# Altium project MiniCar.PrjPcb
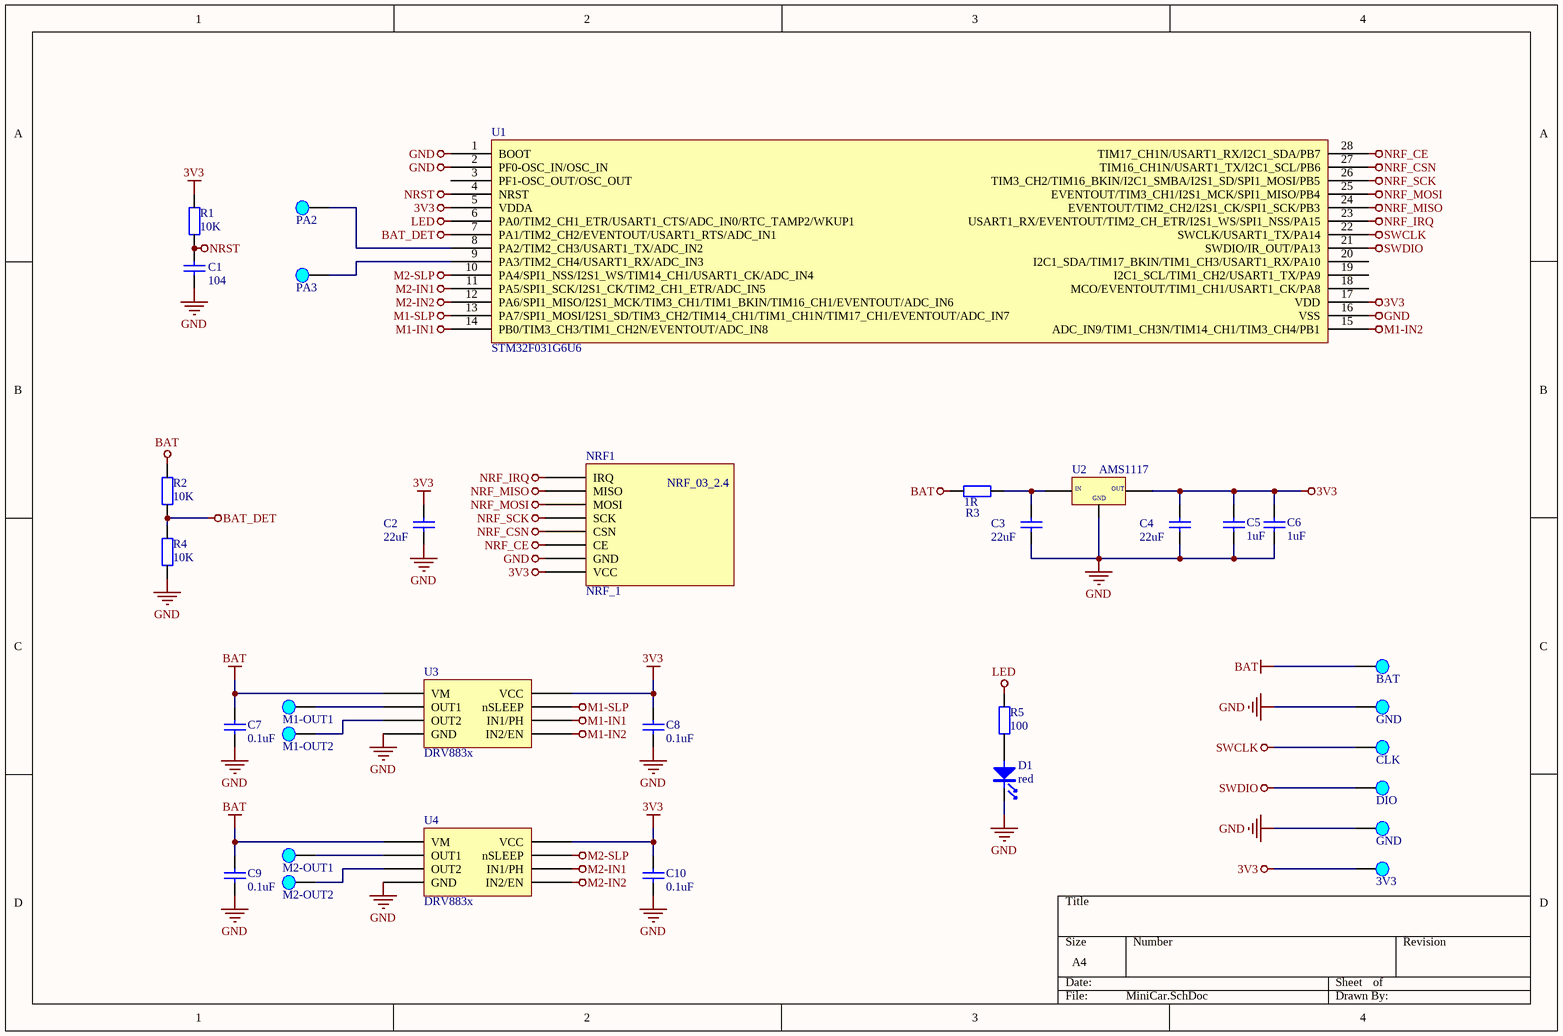
[diagram p0: MiniCar.SchDoc]
1 sheet, 33 parts. Net scope: global (net labels, ports and power ports of the same name join across sheets).
Board file: MiniCar.PcbDoc

## Sheet MiniCar.SchDoc
size A4

### Parts
3V3  3V3  [Pad_B]
BAT  BAT  [Pad_B]
C1  104  [电容_C0603]
C2  22uF  [电容_C1206]
C3  22uF  [电容_C1206]
C4  22uF  [电容_C1206]
C5  1uF  [电容_C0603]
C6  1uF  [电容_C0603]
C7  0.1uF  [电容_C0603]
C8  0.1uF  [电容_C0603]
C9  0.1uF  [电容_C0603]
C10  0.1uF  [电容_C0603]
CLK  CLK  [Pad_B]
D1  red  [LED_0603]
DIO  DIO  [Pad_B]
GND  GND  [Pad_B]
GND2  GND  [Pad_B]
M1+  M1-OUT1  [Pad_B]
M1-  M1-OUT2  [Pad_B]
M2+  M2-OUT1  [Pad_B]
M2-  M2-OUT2  [Pad_B]
NRF1  NRF_1  [NRF-1]
PA2  PA2  [Pad_B]
PA3  PA3  [Pad_B]
R1  10K  [电阻_R0603]
R2  10K  [电阻_R0603]
R3  1R  [电阻_R0603]
R4  10K  [电阻_R0603]
R5  100  [电阻_R0603]
U1  STM32F031G6U6  [ST主控_UFQFPN28]
U2  AMS1117  [稳压芯片_SOT-89]
U3  DRV883x  [WSON-8]
U4  DRV883x  [WSON-8]

### Nets
3V3: 3V3.1 C2.2 C4.2 C5.2 C6.2 C8.2 C10.2 NRF1.1(VCC) R1.2 U1.5(VDDA) U1.17(VDD) U2.2(OUT) U3.8(VCC) U4.8(VCC)
BAT: BAT.1 C7.1 C9.1 R2.2 R3.1 U3.1(VM) U4.1(VM)
BAT_DET: R2.1 R4.2 U1.7(PA1/TIM2_CH2/EVENTOUT/USART1_RTS/ADC_IN1)
GND: C1.1 C2.1 C3.1 C4.1 C5.1 C6.1 C7.2 C8.1 C9.2 C10.1 D1.K GND.1 GND2.1 NRF1.2(GND) R4.1 U1.1(BOOT) U1.2(PF0-OSC_IN/OSC_IN) U1.16(VSS) U2.1(GND) U3.4(GND) U4.4(GND)
LED: R5.1 U1.6(PA0/TIM2_CH1_ETR/USART1_CTS/ADC_IN0/RTC_TAMP2/WKUP1)
M1-IN1: U1.14(PB0/TIM3_CH3/TIM1_CH2N/EVENTOUT/ADC_IN8) U3.6(IN1/PH)
M1-IN2: U1.15(ADC_IN9/TIM1_CH3N/TIM14_CH1/TIM3_CH4/PB1) U3.5(IN2/EN)
M1-SLP: U1.13(PA7/SPI1_MOSI/I2S1_SD/TIM3_CH2/TIM14_CH1/TIM1_CH1N/TIM17_CH1/EVENTOUT/ADC_IN7) U3.7(nSLEEP)
M2-IN1: U1.11(PA5/SPI1_SCK/I2S1_CK/TIM2_CH1_ETR/ADC_IN5) U4.6(IN1/PH)
M2-IN2: U1.12(PA6/SPI1_MISO/I2S1_MCK/TIM3_CH1/TIM1_BKIN/TIM16_CH1/EVENTOUT/ADC_IN6) U4.5(IN2/EN)
M2-SLP: U1.10(PA4/SPI1_NSS/I2S1_WS/TIM14_CH1/USART1_CK/ADC_IN4) U4.7(nSLEEP)
NRF_CE: NRF1.3(CE) U1.28(TIM17_CH1N/USART1_RX/I2C1_SDA/PB7)
NRF_CSN: NRF1.4(CSN) U1.27(TIM16_CH1N/USART1_TX/I2C1_SCL/PB6)
NRF_IRQ: NRF1.8(IRQ) U1.23(USART1_RX/EVENTOUT/TIM2_CH_ETR/I2S1_WS/SPI1_NSS/PA15)
NRF_MISO: NRF1.7(MISO) U1.24(EVENTOUT/TIM2_CH2/I2S1_CK/SPI1_SCK/PB3)
NRF_MOSI: NRF1.6(MOSI) U1.25(EVENTOUT/TIM3_CH1/I2S1_MCK/SPI1_MISO/PB4)
NRF_SCK: NRF1.5(SCK) U1.26(TIM3_CH2/TIM16_BKIN/I2C1_SMBA/I2S1_SD/SPI1_MOSI/PB5)
NRST: C1.2 R1.1 U1.4(NRST)
SWCLK: CLK.1 U1.22(SWCLK/USART1_TX/PA14)
SWDIO: DIO.1 U1.21(SWDIO/IR_OUT/PA13)
NetC3_2: C3.2 R3.2 U2.3(VIN)
NetD1_A: D1.A R5.2
NetM1+_1: M1+.1 U3.2(OUT1)
NetM1-_1: M1-.1 U3.3(OUT2)
NetM2+_1: M2+.1 U4.2(OUT1)
NetM2-_1: M2-.1 U4.3(OUT2)
NetPA2_1: PA2.1 U1.8(PA2/TIM2_CH3/USART1_TX/ADC_IN2)
NetPA3_1: PA3.1 U1.9(PA3/TIM2_CH4/USART1_RX/ADC_IN3)

Not connected (* = marked no-connect by the designer): U1 3(PF1-OSC_OUT/OSC_OUT) 18(MCO/EVENTOUT/TIM1_CH1/USART1_CK/PA8) 19(I2C1_SCL/TIM1_CH2/USART1_TX/PA9) 20(I2C1_SDA/TIM17_BKIN/TIM1_CH3/USART1_RX/PA10)

### Notes on the sheet
- (in symbol AMS1117) IN
- (in symbol NRF_1) NRF_03_2.4

### Library data of the parts
3V3 = Pad: _Funcyusa: Test; _Specification: Pad,Test,3V3; _Comma: ,; _Name: Pad; _Remarks: 3V3
BAT = Pad: _Funcyusa: Test; _Specification: Pad,Test,BAT; _Comma: ,; _Name: Pad; _Remarks: BAT
C1-C10 = cap: U: 50V; 参数: Cap,0805,X7R,104K,50V,125C,±10%
  C1: C: 104
  C2-C4: C: 22uF
  C5 C6: C: 1uF
  C7-C10: C: 0.1uF
CLK = Pad: _Funcyusa: Test; _Specification: Pad,Test,CLK; _Comma: ,; _Name: Pad; _Remarks: CLK
D1 = LED: 参数: LED,0603,Red
DIO = Pad: _Funcyusa: Test; _Specification: Pad,Test,DIO; _Comma: ,; _Name: Pad; _Remarks: DIO
GND GND2 = Pad: _Funcyusa: Test; _Specification: Pad,Test,GND; _Comma: ,; _Name: Pad; _Remarks: GND
M1+ = Pad: _Funcyusa: Test; _Specification: Pad,Test,M1-OUT1; _Comma: ,; _Name: Pad; _Remarks: M1-OUT1
M1- = Pad: _Funcyusa: Test; _Specification: Pad,Test,M1-OUT2; _Comma: ,; _Name: Pad; _Remarks: M1-OUT2
M2+ = Pad: _Funcyusa: Test; _Specification: Pad,Test,M2-OUT1; _Comma: ,; _Name: Pad; _Remarks: M2-OUT1
M2- = Pad: _Funcyusa: Test; _Specification: Pad,Test,M2-OUT2; _Comma: ,; _Name: Pad; _Remarks: M2-OUT2
PA2 = Pad: _Funcyusa: Test; _Specification: Pad,Test,PA2; _Comma: ,; _Name: Pad; _Remarks: PA2
PA3 = Pad: _Funcyusa: Test; _Specification: Pad,Test,PA3; _Comma: ,; _Name: Pad; _Remarks: PA3
R1-R5 = Res: P: 1/8W; 参数: Res,0805,0R,±1%,1/8W,100ppm,155C
  R1 R2 R4: R: 10K
  R3: R: 1R
  R5: R: 100